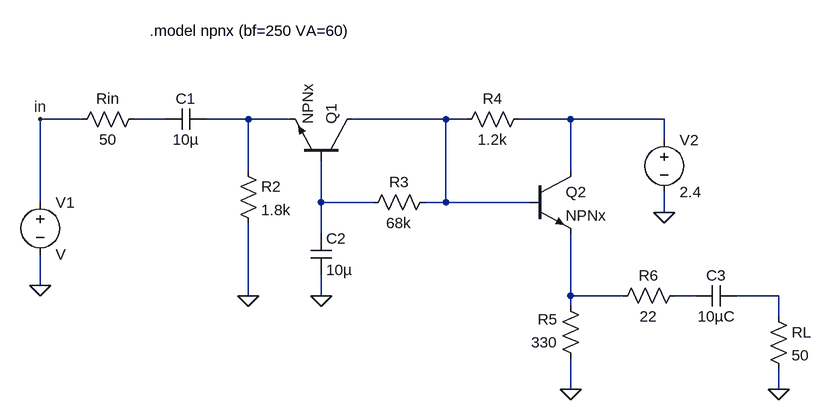
[diagram p0: schematic ampl.asc]
ampl.asc, the LTspice schematic file:
Version 4
SHEET 1 1304 680
WIRE 160 16 96 16
WIRE 288 16 240 16
WIRE 416 16 352 16
WIRE 480 16 416 16
WIRE 720 16 576 16
WIRE 752 16 720 16
WIRE 912 16 832 16
WIRE 1056 16 912 16
WIRE 1056 48 1056 16
WIRE 416 96 416 16
WIRE 912 96 912 16
WIRE 96 144 96 16
WIRE 528 144 528 80
WIRE 608 144 528 144
WIRE 720 144 720 16
WIRE 720 144 688 144
WIRE 848 144 720 144
WIRE 1056 160 1056 128
WIRE 528 192 528 144
WIRE 96 272 96 224
WIRE 416 288 416 176
WIRE 528 288 528 256
WIRE 912 288 912 192
WIRE 992 288 912 288
WIRE 1104 288 1072 288
WIRE 1232 288 1168 288
WIRE 912 304 912 288
WIRE 1232 320 1232 288
WIRE 912 432 912 384
WIRE 1232 432 1232 400
FLAG 1232 432 0
FLAG 912 432 0
FLAG 528 288 0
FLAG 96 272 0
FLAG 416 288 0
FLAG 1056 160 0
FLAG 96 16 in
SYMBOL voltage 96 128 R0
SYMATTR InstName V1
SYMBOL res 256 0 R90
WINDOW 0 0 56 VBottom 2
WINDOW 3 32 56 VTop 2
SYMATTR InstName Rin
SYMATTR Value 50
SYMBOL cap 352 0 R90
WINDOW 0 0 32 VBottom 2
WINDOW 3 32 32 VTop 2
SYMATTR InstName C1
SYMATTR Value 10µ
SYMBOL res 400 80 R0
SYMATTR InstName R2
SYMATTR Value 1.8k
SYMBOL npn 576 80 M270
SYMATTR InstName Q1
SYMATTR Value NPNx
SYMBOL cap 512 192 R0
SYMATTR InstName C2
SYMATTR Value 10µ
SYMBOL res 704 128 R90
WINDOW 0 0 56 VBottom 2
WINDOW 3 32 56 VTop 2
SYMATTR InstName R3
SYMATTR Value 68k
SYMBOL res 848 0 R90
WINDOW 0 0 56 VBottom 2
WINDOW 3 32 56 VTop 2
SYMATTR InstName R4
SYMATTR Value 1.2k
SYMBOL res 928 400 R180
WINDOW 0 36 76 Left 2
WINDOW 3 36 40 Left 2
SYMATTR InstName R5
SYMATTR Value 330
SYMBOL npn 848 96 R0
SYMATTR InstName Q2
SYMATTR Value NPNx
SYMBOL res 1088 272 R90
WINDOW 0 0 56 VBottom 2
WINDOW 3 32 56 VTop 2
SYMATTR InstName R6
SYMATTR Value 22
SYMBOL cap 1168 272 R90
WINDOW 0 0 32 VBottom 2
WINDOW 3 32 32 VTop 2
SYMATTR InstName C3
SYMATTR Value 10µC
SYMBOL res 1216 304 R0
SYMATTR InstName RL
SYMATTR Value 50
SYMBOL voltage 1056 32 R0
WINDOW 123 0 0 Left 2
WINDOW 39 0 0 Left 2
SYMATTR InstName V2
SYMATTR Value 2.4
TEXT 264 -120 Left 2 !.model npnx (bf=250 VA=60)

The netlist it stands for:
* ampl.asc
V1 in 0 V
Rin N001 in 50
C1 N002 N001 10µ
R2 N002 0 1.8k
Q1 N003 N005 N002 0 NPNx
C2 N005 0 10µ
R3 N003 N005 68k
R4 N004 N003 1.2k
R5 0 N006 330
Q2 N004 N003 N006 0 NPNx
R6 N007 N006 22
C3 N008 N007 10µC
RL N008 0 50
V2 N004 0 2.4
.model NPN NPN
.model PNP PNP
.lib standard.bjt
.model npnx (bf=250 VA=60)
.backanno
.end